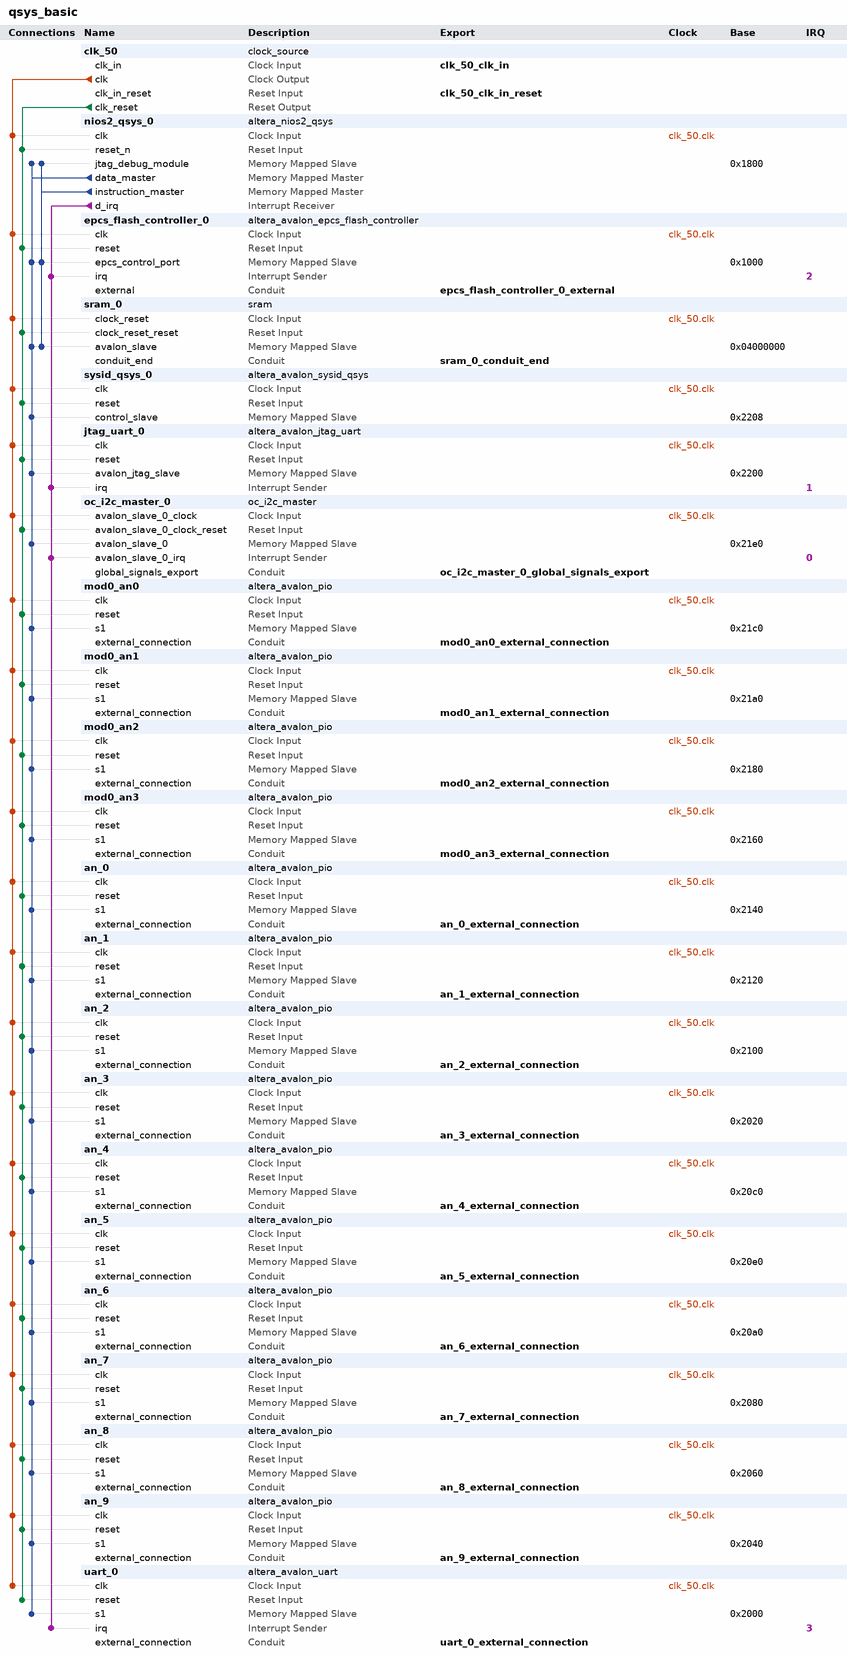
[diagram p0: system contents]
# Platform Designer (Qsys) system qsys_basic, Cyclone IV E EP4CE10F17C9L
# Parameters at their usual value, and those the tool derives, are not listed.
package require -exact qsys 13.0.1.99.2
create_system qsys_basic
set_project_property DEVICE_FAMILY {Cyclone IV E}
set_project_property DEVICE EP4CE10F17C9L

add_instance clk_50 clock_source 13.0
set_instance_parameter_value clk_50 clockFrequency 50000000

add_instance nios2_qsys_0 altera_nios2_qsys 13.0
set_instance_parameter_value nios2_qsys_0 resetSlave epcs_flash_controller_0.epcs_control_port
set_instance_parameter_value nios2_qsys_0 exceptionSlave sram_0.avalon_slave
set_instance_parameter_value nios2_qsys_0 breakSlave nios2_qsys_0.jtag_debug_module
set_instance_parameter_value nios2_qsys_0 impl Tiny
set_instance_parameter_value nios2_qsys_0 icache_size 512

add_instance epcs_flash_controller_0 altera_avalon_epcs_flash_controller 13.0.1.99.2

add_instance sram_0 sram 1.0
set_instance_parameter_value sram_0 DATA_BITS 16
set_instance_parameter_value sram_0 ADDR_BITS 18

add_instance sysid_qsys_0 altera_avalon_sysid_qsys 13.0
set_instance_parameter_value sysid_qsys_0 id 305441741

add_instance jtag_uart_0 altera_avalon_jtag_uart 13.0.1.99.2
set_instance_parameter_value jtag_uart_0 simInteractiveOptions INTERACTIVE_ASCII_OUTPUT

add_instance oc_i2c_master_0 oc_i2c_master 1.2

add_instance mod0_an0 altera_avalon_pio 13.0.1.99.2
set_instance_parameter_value mod0_an0 bitModifyingOutReg true
set_instance_parameter_value mod0_an0 direction Input
set_instance_parameter_value mod0_an0 width 12

add_instance mod0_an1 altera_avalon_pio 13.0.1.99.2
set_instance_parameter_value mod0_an1 bitModifyingOutReg true
set_instance_parameter_value mod0_an1 direction Input
set_instance_parameter_value mod0_an1 width 12

add_instance mod0_an2 altera_avalon_pio 13.0.1.99.2
set_instance_parameter_value mod0_an2 bitModifyingOutReg true
set_instance_parameter_value mod0_an2 direction Input
set_instance_parameter_value mod0_an2 width 12

add_instance mod0_an3 altera_avalon_pio 13.0.1.99.2
set_instance_parameter_value mod0_an3 bitModifyingOutReg true
set_instance_parameter_value mod0_an3 direction Input
set_instance_parameter_value mod0_an3 width 12

add_instance an_0 altera_avalon_pio 13.0.1.99.2
set_instance_parameter_value an_0 bitModifyingOutReg true
set_instance_parameter_value an_0 direction Input
set_instance_parameter_value an_0 width 12

add_instance an_1 altera_avalon_pio 13.0.1.99.2
set_instance_parameter_value an_1 bitModifyingOutReg true
set_instance_parameter_value an_1 direction Input
set_instance_parameter_value an_1 width 12

add_instance an_2 altera_avalon_pio 13.0.1.99.2
set_instance_parameter_value an_2 bitModifyingOutReg true
set_instance_parameter_value an_2 direction Input
set_instance_parameter_value an_2 width 12

add_instance an_3 altera_avalon_pio 13.0.1.99.2
set_instance_parameter_value an_3 bitModifyingOutReg true
set_instance_parameter_value an_3 direction Input
set_instance_parameter_value an_3 width 12

add_instance an_4 altera_avalon_pio 13.0.1.99.2
set_instance_parameter_value an_4 bitModifyingOutReg true
set_instance_parameter_value an_4 direction Input
set_instance_parameter_value an_4 width 12

add_instance an_5 altera_avalon_pio 13.0.1.99.2
set_instance_parameter_value an_5 bitModifyingOutReg true
set_instance_parameter_value an_5 direction Input
set_instance_parameter_value an_5 width 12

add_instance an_6 altera_avalon_pio 13.0.1.99.2
set_instance_parameter_value an_6 bitModifyingOutReg true
set_instance_parameter_value an_6 direction Input
set_instance_parameter_value an_6 width 12

add_instance an_7 altera_avalon_pio 13.0.1.99.2
set_instance_parameter_value an_7 bitModifyingOutReg true
set_instance_parameter_value an_7 direction Input
set_instance_parameter_value an_7 width 12

add_instance an_8 altera_avalon_pio 13.0.1.99.2
set_instance_parameter_value an_8 bitModifyingOutReg true
set_instance_parameter_value an_8 direction Input
set_instance_parameter_value an_8 width 12

add_instance an_9 altera_avalon_pio 13.0.1.99.2
set_instance_parameter_value an_9 bitModifyingOutReg true
set_instance_parameter_value an_9 direction Input
set_instance_parameter_value an_9 width 12

add_instance uart_0 altera_avalon_uart 13.0.1.99.2
set_instance_parameter_value uart_0 baud 115200
set_instance_parameter_value uart_0 dataBits 8
set_instance_parameter_value uart_0 fixedBaud false
set_instance_parameter_value uart_0 parity NONE
set_instance_parameter_value uart_0 stopBits 1

# connections
add_connection clk_50.clk an_0.clk clock
add_connection clk_50.clk an_1.clk clock
add_connection clk_50.clk an_2.clk clock
add_connection clk_50.clk an_3.clk clock
add_connection clk_50.clk an_4.clk clock
add_connection clk_50.clk an_5.clk clock
add_connection clk_50.clk an_6.clk clock
add_connection clk_50.clk an_7.clk clock
add_connection clk_50.clk an_8.clk clock
add_connection clk_50.clk an_9.clk clock
add_connection clk_50.clk epcs_flash_controller_0.clk clock
add_connection clk_50.clk jtag_uart_0.clk clock
add_connection clk_50.clk mod0_an0.clk clock
add_connection clk_50.clk mod0_an1.clk clock
add_connection clk_50.clk mod0_an2.clk clock
add_connection clk_50.clk mod0_an3.clk clock
add_connection clk_50.clk nios2_qsys_0.clk clock
add_connection clk_50.clk oc_i2c_master_0.avalon_slave_0_clock clock
add_connection clk_50.clk sram_0.clock_reset clock
add_connection clk_50.clk sysid_qsys_0.clk clock
add_connection clk_50.clk uart_0.clk clock
add_connection clk_50.clk_reset an_0.reset reset
add_connection clk_50.clk_reset an_1.reset reset
add_connection clk_50.clk_reset an_2.reset reset
add_connection clk_50.clk_reset an_3.reset reset
add_connection clk_50.clk_reset an_4.reset reset
add_connection clk_50.clk_reset an_5.reset reset
add_connection clk_50.clk_reset an_6.reset reset
add_connection clk_50.clk_reset an_7.reset reset
add_connection clk_50.clk_reset an_8.reset reset
add_connection clk_50.clk_reset an_9.reset reset
add_connection clk_50.clk_reset epcs_flash_controller_0.reset reset
add_connection clk_50.clk_reset jtag_uart_0.reset reset
add_connection clk_50.clk_reset mod0_an0.reset reset
add_connection clk_50.clk_reset mod0_an1.reset reset
add_connection clk_50.clk_reset mod0_an2.reset reset
add_connection clk_50.clk_reset mod0_an3.reset reset
add_connection clk_50.clk_reset nios2_qsys_0.reset_n reset
add_connection clk_50.clk_reset oc_i2c_master_0.avalon_slave_0_clock_reset reset
add_connection clk_50.clk_reset sram_0.clock_reset_reset reset
add_connection clk_50.clk_reset sysid_qsys_0.reset reset
add_connection clk_50.clk_reset uart_0.reset reset
add_connection nios2_qsys_0.data_master an_0.s1 avalon
set_connection_parameter_value nios2_qsys_0.data_master/an_0.s1 baseAddress 0x2140
add_connection nios2_qsys_0.data_master an_1.s1 avalon
set_connection_parameter_value nios2_qsys_0.data_master/an_1.s1 baseAddress 0x2120
add_connection nios2_qsys_0.data_master an_2.s1 avalon
set_connection_parameter_value nios2_qsys_0.data_master/an_2.s1 baseAddress 0x2100
add_connection nios2_qsys_0.data_master an_3.s1 avalon
set_connection_parameter_value nios2_qsys_0.data_master/an_3.s1 baseAddress 0x2020
add_connection nios2_qsys_0.data_master an_4.s1 avalon
set_connection_parameter_value nios2_qsys_0.data_master/an_4.s1 baseAddress 0x20c0
add_connection nios2_qsys_0.data_master an_5.s1 avalon
set_connection_parameter_value nios2_qsys_0.data_master/an_5.s1 baseAddress 0x20e0
add_connection nios2_qsys_0.data_master an_6.s1 avalon
set_connection_parameter_value nios2_qsys_0.data_master/an_6.s1 baseAddress 0x20a0
add_connection nios2_qsys_0.data_master an_7.s1 avalon
set_connection_parameter_value nios2_qsys_0.data_master/an_7.s1 baseAddress 0x2080
add_connection nios2_qsys_0.data_master an_8.s1 avalon
set_connection_parameter_value nios2_qsys_0.data_master/an_8.s1 baseAddress 0x2060
add_connection nios2_qsys_0.data_master an_9.s1 avalon
set_connection_parameter_value nios2_qsys_0.data_master/an_9.s1 baseAddress 0x2040
add_connection nios2_qsys_0.data_master epcs_flash_controller_0.epcs_control_port avalon
set_connection_parameter_value nios2_qsys_0.data_master/epcs_flash_controller_0.epcs_control_port baseAddress 0x1000
add_connection nios2_qsys_0.data_master jtag_uart_0.avalon_jtag_slave avalon
set_connection_parameter_value nios2_qsys_0.data_master/jtag_uart_0.avalon_jtag_slave baseAddress 0x2200
add_connection nios2_qsys_0.data_master mod0_an0.s1 avalon
set_connection_parameter_value nios2_qsys_0.data_master/mod0_an0.s1 baseAddress 0x21c0
add_connection nios2_qsys_0.data_master mod0_an1.s1 avalon
set_connection_parameter_value nios2_qsys_0.data_master/mod0_an1.s1 baseAddress 0x21a0
add_connection nios2_qsys_0.data_master mod0_an2.s1 avalon
set_connection_parameter_value nios2_qsys_0.data_master/mod0_an2.s1 baseAddress 0x2180
add_connection nios2_qsys_0.data_master mod0_an3.s1 avalon
set_connection_parameter_value nios2_qsys_0.data_master/mod0_an3.s1 baseAddress 0x2160
add_connection nios2_qsys_0.data_master nios2_qsys_0.jtag_debug_module avalon
set_connection_parameter_value nios2_qsys_0.data_master/nios2_qsys_0.jtag_debug_module baseAddress 0x1800
add_connection nios2_qsys_0.data_master oc_i2c_master_0.avalon_slave_0 avalon
set_connection_parameter_value nios2_qsys_0.data_master/oc_i2c_master_0.avalon_slave_0 baseAddress 0x21e0
add_connection nios2_qsys_0.data_master sram_0.avalon_slave avalon
set_connection_parameter_value nios2_qsys_0.data_master/sram_0.avalon_slave baseAddress 0x04000000
add_connection nios2_qsys_0.data_master sysid_qsys_0.control_slave avalon
set_connection_parameter_value nios2_qsys_0.data_master/sysid_qsys_0.control_slave baseAddress 0x2208
add_connection nios2_qsys_0.data_master uart_0.s1 avalon
set_connection_parameter_value nios2_qsys_0.data_master/uart_0.s1 baseAddress 0x2000
add_connection nios2_qsys_0.instruction_master epcs_flash_controller_0.epcs_control_port avalon
set_connection_parameter_value nios2_qsys_0.instruction_master/epcs_flash_controller_0.epcs_control_port baseAddress 0x1000
add_connection nios2_qsys_0.instruction_master nios2_qsys_0.jtag_debug_module avalon
set_connection_parameter_value nios2_qsys_0.instruction_master/nios2_qsys_0.jtag_debug_module baseAddress 0x1800
add_connection nios2_qsys_0.instruction_master sram_0.avalon_slave avalon
set_connection_parameter_value nios2_qsys_0.instruction_master/sram_0.avalon_slave baseAddress 0x04000000
add_connection nios2_qsys_0.d_irq epcs_flash_controller_0.irq interrupt
set_connection_parameter_value nios2_qsys_0.d_irq/epcs_flash_controller_0.irq irqNumber 2
add_connection nios2_qsys_0.d_irq jtag_uart_0.irq interrupt
set_connection_parameter_value nios2_qsys_0.d_irq/jtag_uart_0.irq irqNumber 1
add_connection nios2_qsys_0.d_irq oc_i2c_master_0.avalon_slave_0_irq interrupt
set_connection_parameter_value nios2_qsys_0.d_irq/oc_i2c_master_0.avalon_slave_0_irq irqNumber 0
add_connection nios2_qsys_0.d_irq uart_0.irq interrupt
set_connection_parameter_value nios2_qsys_0.d_irq/uart_0.irq irqNumber 3

# exported interfaces
add_interface oc_i2c_master_0_global_signals_export conduit end
set_interface_property oc_i2c_master_0_global_signals_export EXPORT_OF oc_i2c_master_0.global_signals_export
add_interface clk_50_clk_in_reset reset sink
set_interface_property clk_50_clk_in_reset EXPORT_OF clk_50.clk_in_reset
add_interface clk_50_clk_in clock sink
set_interface_property clk_50_clk_in EXPORT_OF clk_50.clk_in
add_interface epcs_flash_controller_0_external conduit end
set_interface_property epcs_flash_controller_0_external EXPORT_OF epcs_flash_controller_0.external
add_interface mod0_an0_external_connection conduit end
set_interface_property mod0_an0_external_connection EXPORT_OF mod0_an0.external_connection
add_interface sram_0_conduit_end conduit end
set_interface_property sram_0_conduit_end EXPORT_OF sram_0.conduit_end
add_interface an_9_external_connection conduit end
set_interface_property an_9_external_connection EXPORT_OF an_9.external_connection
add_interface an_8_external_connection conduit end
set_interface_property an_8_external_connection EXPORT_OF an_8.external_connection
add_interface an_7_external_connection conduit end
set_interface_property an_7_external_connection EXPORT_OF an_7.external_connection
add_interface an_6_external_connection conduit end
set_interface_property an_6_external_connection EXPORT_OF an_6.external_connection
add_interface an_5_external_connection conduit end
set_interface_property an_5_external_connection EXPORT_OF an_5.external_connection
add_interface an_4_external_connection conduit end
set_interface_property an_4_external_connection EXPORT_OF an_4.external_connection
add_interface an_3_external_connection conduit end
set_interface_property an_3_external_connection EXPORT_OF an_3.external_connection
add_interface an_2_external_connection conduit end
set_interface_property an_2_external_connection EXPORT_OF an_2.external_connection
add_interface an_1_external_connection conduit end
set_interface_property an_1_external_connection EXPORT_OF an_1.external_connection
add_interface an_0_external_connection conduit end
set_interface_property an_0_external_connection EXPORT_OF an_0.external_connection
add_interface mod0_an3_external_connection conduit end
set_interface_property mod0_an3_external_connection EXPORT_OF mod0_an3.external_connection
add_interface mod0_an2_external_connection conduit end
set_interface_property mod0_an2_external_connection EXPORT_OF mod0_an2.external_connection
add_interface mod0_an1_external_connection conduit end
set_interface_property mod0_an1_external_connection EXPORT_OF mod0_an1.external_connection
add_interface uart_0_external_connection conduit end
set_interface_property uart_0_external_connection EXPORT_OF uart_0.external_connection

set_interconnect_requirement {$system} qsys_mm.clockCrossingAdapter AUTO
set_interconnect_requirement {$system} qsys_mm.maxAdditionalLatency 1

save_system qsys_basic.qsys
